# Altium schematic sheet power.SchDoc
size A4; SheetNumber: 24; SheetTotal: 25
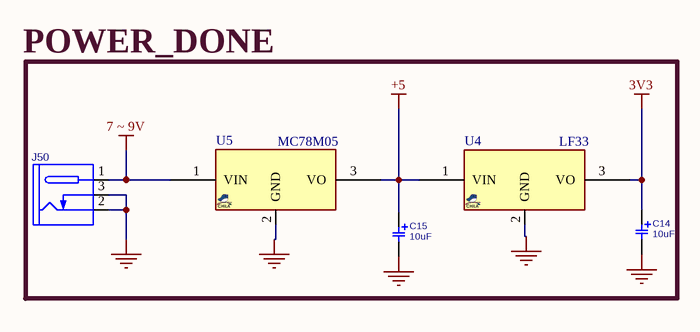
[diagram p0: power.SchDoc]

## Parts
C14  10uF  [C_EL_4X7]
C15  10uF  [C_EL_4X7]
J50  DC_POWER_JACK  [JAC_PWR1]  (value not drawn)
U4  LF33  [TO220_3]
U5  MC78M05  [TO220_3]

## Blocks framed on the sheet
POWER_DONE: C14 C15 J50 U4 U5

## Nets
3V3: C14.1 U4.3(VO)
7 ~ 9V: J50.1(TIP) U5.1(VIN)
+5: C15.1 U4.1(VIN) U5.3(VO)
GND: C14.2 C15.2 J50.2(SLEEVE) J50.3(INSERTION_DET) U4.2(GND) U5.2(GND)

## Library data of the parts
C14 C15 = CAP_THD_EL_10u25V: CAP, THD, ELEC, 10uF, 25V; MANF_P#: MANF_PART#; PARAM: 25V; MANF: MANF; PARAM2: PARAM2; VALUE: 10uF
J50 = CONN_PWR_JACKR1: CONN, PWR JACK DC, PLUG DIAM 1.0MM RA THD; MANF: CUI STACK; MANF_P#: PJ-031CH, PJ-031C; PARAM: CH 3A, C 2A; VALUE: DC_POWER_JACK
U4 = VREG_LFXX_TO220: REG, Linear, LDO0.45V, 0.5A, TO-220; MANF: ST; PARAM2: 1.5/1.8/2.5/3.3/5V; MANF_P#: LF33; PARAM: LDO0.45V, 0.5A; PRICE: 1500t; VALUE: LF33
U5 = VREG_78M05_TO220: REG, Linear, Fixed, 5v, 1.5A, TO-220; MANF_P#: LM78M05CT, LM7805CT, LM7805ACT, UA7805CKC, L7805ABV, L7805ACV, L7805CV, L78M05CV, KA78T05, KA7805ETU, MC78M05BT, MC78M05CT, MC7805ACT, MC7805ABT, NCP7805TG, NJM7805FA, TS7805CZ; MANF: TI, ST, FAIRCHILD, ON, NJR, TS; PARAM: 5v, 1.5A; PARAM2: PARAM2; VALUE: MC78M05